# EAGLE design tiny13_charlie4_50mm_boosted_optical_diag_leafpattern (EAGLE 6.2)
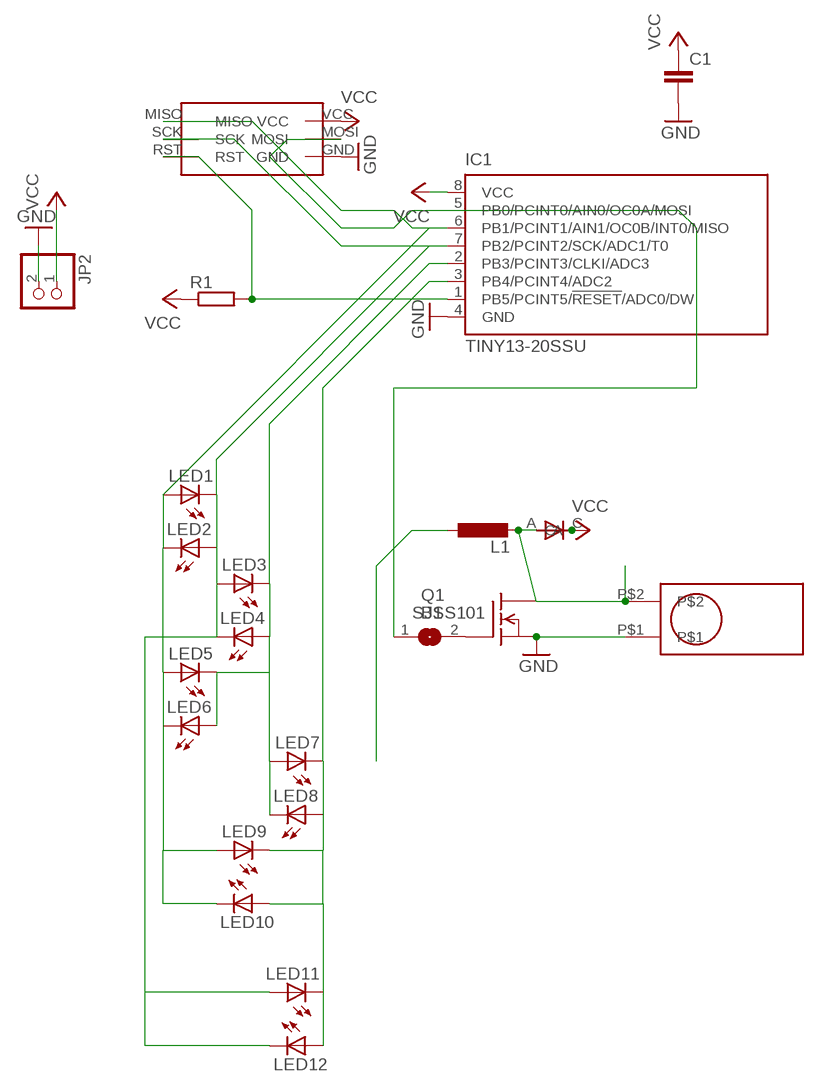
[diagram p0: schematic, sheet 1]

## Parts
C1  C-EU025-025X050  [C025-025X050]
IC1  TINY13-20SSU  [8S1]
JP2  PINHD-1X2  [1X02]
L1  L-EU0204/5  [0204/5]
LED1  LED3MM  [LED3MM]
LED2  LED3MM  [LED3MM]
LED3  LED3MM  [LED3MM]
LED4  LED3MM  [LED3MM]
LED5  LED3MM  [LED3MM]
LED6  LED3MM  [LED3MM]
LED7  LED3MM  [LED3MM]
LED8  LED3MM  [LED3MM]
LED9  LED3MM  [LED3MM]
LED10  LED3MM  [LED3MM]
LED11  LED3MM  [LED3MM]
LED12  LED3MM  [LED3MM]
Q1  BSS101  [TO92]
R1  R-EU_0204/5  [0204/5]
SJ1  SJ  [SJ]
U$1  TILT_SWITCH_MECHANICAL  [TILT_SWITCH_MECHANICAL]
U$2  AVR_ISP_6_PIN_1X6_SMT_CONTACT_PROGRAMMER  [CONTACT_ISP_PROGRAMMER_1X6_ATMEL_2]
U$3  D-6  [D-7.5]

## Nets
GND: C1.2 IC1.4(GND) JP2.2 Q1.1(S) U$1.P$1 U$2.GND
N$1: IC1.2(PB3/PCINT3/CLKI/ADC3) LED3.K(C) LED4.A LED5.K(C) LED6.A LED7.A LED8.K(C)
N$2: IC1.7(PB2/PCINT2/SCK/ADC1/T0) LED1.K(C) LED2.A LED3.A LED4.K(C) LED11.A LED12.K(C) U$2.SCK
N$3: L1.2 Q1.3(D) U$1.P$2 U$3.A
N$4: IC1.3(PB4/PCINT4/ADC2) LED7.K(C) LED8.A LED9.K(C) LED10.A LED11.K(C) LED12.A
N$5: IC1.5(PB0/PCINT0/AIN0/OC0A/MOSI) SJ1.1 U$2.MOSI
N$6: IC1.1(PB5/PCINT5/!RESET!/ADC0/DW) R1.2 U$2.RST
N$8: IC1.6(PB1/PCINT1/AIN1/OC0B/INT0/MISO) LED1.A LED2.K(C) LED5.A LED6.K(C) LED9.A LED10.K(C) U$2.MISO
N$9: Q1.2(G) SJ1.2
N$11: L1.1
VCC: C1.1 IC1.8(VCC) JP2.1 R1.1 U$2.VCC U$3.C

## Library data of the parts
C1 = resistor:C-EU: CAPACITOR, European symbol
IC1 = atmel:TINY13: 8-bit AVR Microcontroller with 1K Bytes In-System Programmable Flash Source: http://www.atmel.com/dyn/resources/prod_documents/2535S.pdf; MPN: ATTINY13-20SSU; OC_FARNELL: 1455133; OC_NEWARK: 58M3771
JP2 = pinhead:PINHD-1X2: PIN HEADER
L1 = rcl:L-EU: INDUCTOR, European symbol
LED1-LED12 = 0-svo:LED: LED OSRAM: - CHIPLED LG R971, LG N971, LY N971, LG Q971, LY Q971, LO R971, LY R971 LH N974, LH R974 LS Q976, LO Q976, LY Q976 LO Q996 - Hyper CHIPLED LW Q18S LB Q993, LB Q99A, LB R99A - SideLED LS A670, LO A670, LY A670, LG A670, LP A670 LB A673, LV A673, LT A673, LW A673 LH A674 LY A675 LS A676, LA A676, LO A676, LY A676, LW A676 LS A679, LY A679, LG A679 - Hyper Micro SIDELED® LS Y876, LA Y876, LO Y876, LY Y876 LT Y87S - SmartLED LW L88C, LW L88S LB L89C, LB L89S, LG L890 LS L89K, LO L89K, LY L89K LS L896, LA L896, LO L896, LY L896 - TOPLED LS T670, LO T670, LY T670, LG T670, LP T670 LSG T670, LSP T670, LSY T670, LOP T670, LYG T670 LG T671, LOG T671, LSG T671 LB T673, LV T673, LT T673, LW T673 LH T674 LS T676, LA T676, LO T676, LY T676, LB T676, LH T676, LSB T676, LW T676 LB T67C, LV T67C, LT T67C, LS T67K, LO T67K, LY T67K, LW E67C LS E67B, LA E67B, LO E67B, LY E67B, LB E67C, LV E67C, LT E67C LW T67C LS T679, LY T679, LG T679 LS T770, LO T770, LY T770, LG T770, LP T770 LB T773, LV T773, LT T773, LW T773 LH T774 LS E675, LA E675, LY E675, LS T675 LS T776, LA T776, LO T776, LY T776, LB T776 LHGB T686 LT T68C, LB T68C - Hyper Mini TOPLED® LB M676 - Mini TOPLED Santana® LG M470 LS M47K, LO M47K, LY M47K Source: http://www.osram.convergy.de/
Q1 = transistor-fet:BSS101: N-Channel Enhancement MOSFET 200V; 0,16A; 11Ohm
R1 = resistor:R-EU_: RESISTOR, European symbol
SJ1 = jumper:SJ: SMD solder JUMPER
U$1 = Mrule:TILT_SWITCH_MECHANICAL
U$2 = Mrule:AVR_ISP_6_PIN_1X6_SMT_CONTACT_PROGRAMMER
U$3 = Mrule:D-6

## Board
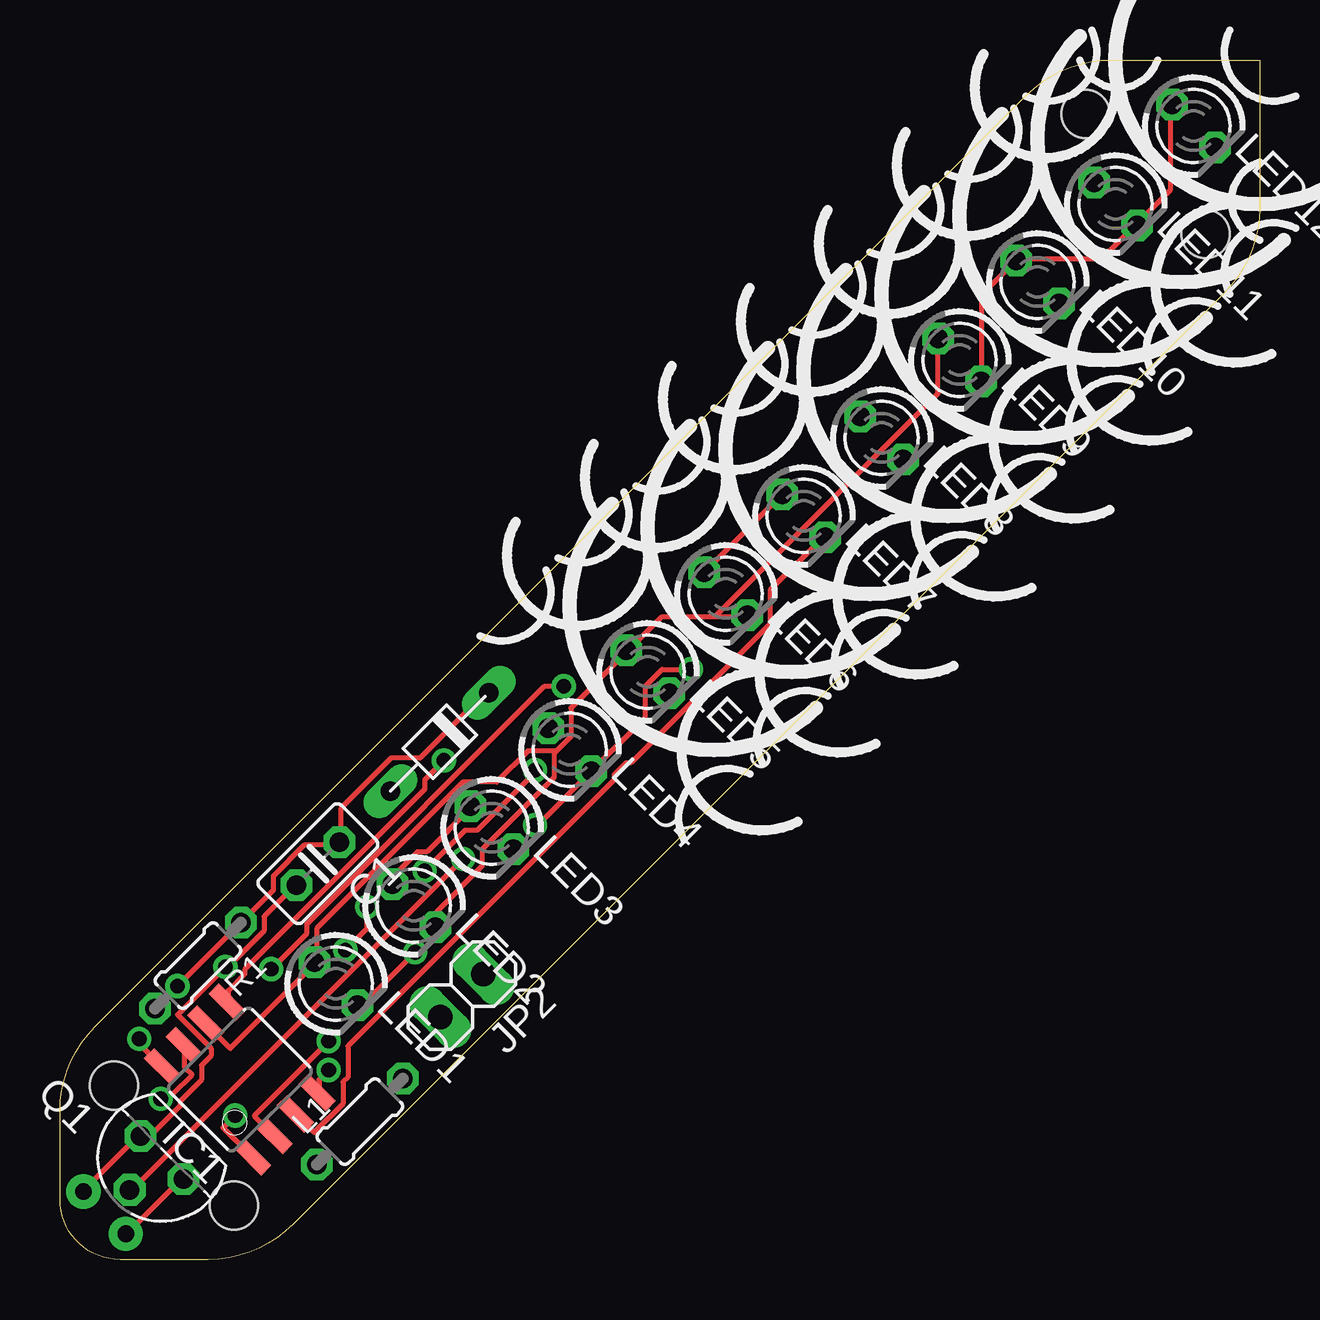
[diagram p1: board, top side]
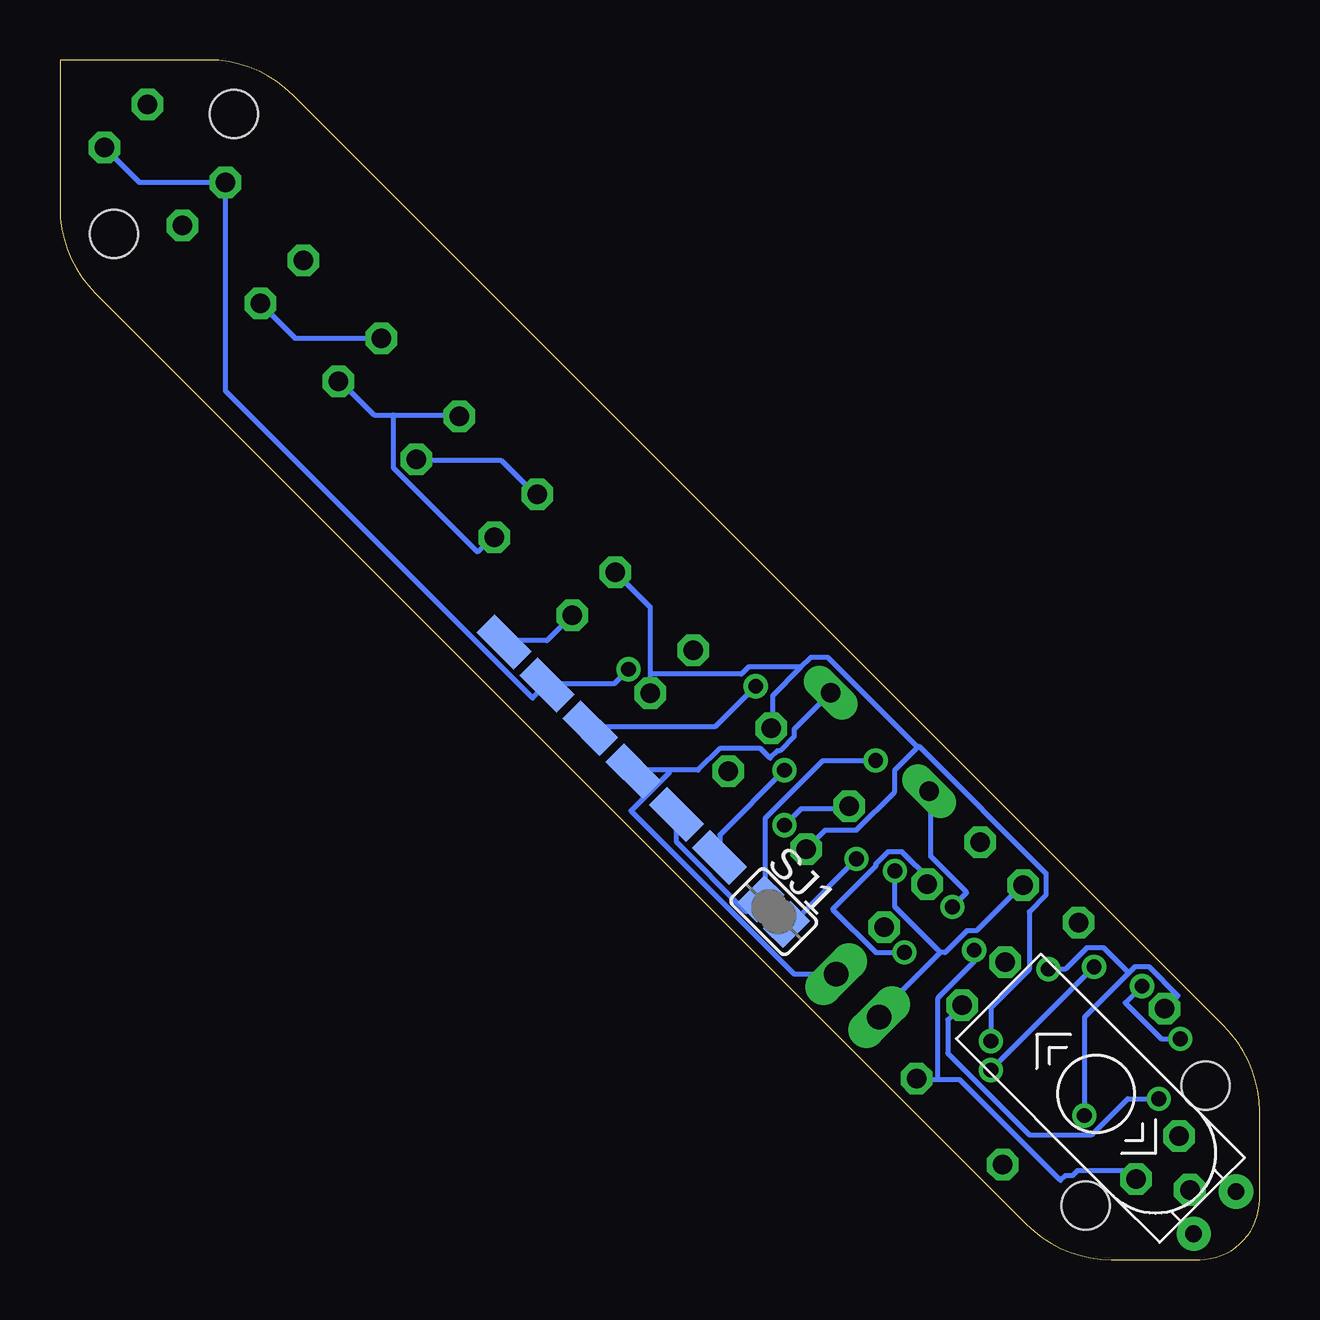
[diagram p2: board, bottom side, seen from below]

Size 50 x 50 mm. Coordinates in mm from the lower left corner, seen from the top.
Outline: 43.82,50 50,50 50,43.82 arc-45 48.54,40.29 9.71,1.46 arc-45 6.18,0 2.5,0 arc-90 0,2.5 0,6.18 arc-45 1.46,9.71 40.29,48.54 arc-45 43.82,50
Copper layers (1*16): Top 0.035mm / dielectric 1.5mm / Bottom 0.035mm
Design rules: minimum track width 8mil, minimum drill 24mil, track to track 6mil, track to pad 6mil, pad to pad 6mil, via to via 6mil, smd to smd 0mil, copper to edge 10mil, drill to drill 8mil, minimum pad ring 10mil, minimum via ring 8mil, stop-mask expansion 4mil, vias tented up to drill 0mil, thermal gap 10mil
Holes 2 mm at 42.75,47.75 47.75,42.75 7.25,2.25 2.25,7.25

### Footprints (pad centres in the part's own frame; a part is rotated, then mirrored left to right if it is on the bottom)
C025-025X050 = drill 0.813 octagon: 1 -1.27,0; 2 1.27,0
8S1 = smd 0.6 x 1.6: 1 -1.905,-2.654; 2 -0.645,-2.654; 3 0.625,-2.654; 4 1.895,-2.654; 5 1.905,2.654; 6 0.635,2.654; 7 -0.635,2.654; 8 -1.905,2.654
1X02 = drill 1.016 long: 1 -1.27,0; 2 1.27,0
0204/5 = drill 0.813 octagon: 1 -2.54,0; 2 2.54,0
LED3MM = drill 0.813 octagon: A -1.27,0; K 1.27,0
TO92 = drill 0.813 octagon: 1 1.27,0; 2 0,1.905; 3 -1.27,0
SJ = smd 1.168 x 1.6: 1 -0.762,0; 2 0.762,0
TILT_SWITCH_MECHANICAL = drill 0.7 pad 1.422: P$1 -0.75,1.25; P$2 -0.75,3.75
CONTACT_ISP_PROGRAMMER_1X6_ATMEL_2 = smd 2.184 x 1.067: GND 6.35,0; MISO -6.35,0; MOSI 3.81,0; RST -1.27,0; SCK -3.81,0; VCC 1.27,0
D-7.5 = drill 0.813 long: A 2.81,0; C -3,0

### Placement (x,y rotation side)
C1  10.75,16.5 225 top
IC1  7.5,7.5 45 top
JP2  16.75,11 225 top
L1  12.5,5.75 45 top
LED1  11.5,11.5 315 top
LED2  14.75,14.75 315 top
LED3  18,18 315 top
LED4  21.25,21.25 315 top
LED5  24.5,24.5 315 top
LED6  27.75,27.75 315 top
LED7  31,31 315 top
LED8  34.25,34.25 315 top
LED9  37.5,37.5 315 top
LED10  40.75,40.75 315 top
LED11  44,44 315 top
LED12  47.25,47.25 315 top
Q1  4.25,4.25 135 top
R1  5.75,12.25 225 top
SJ1  20.25,14.5 315 bottom
U$1  0.62,4.25 135 bottom
U$2  27,21.25 315 bottom
U$3  15.75,21.5 225 top

### Tracks (layer width: path | path; a pad name or v marks a point on that pad's centre or on a via)
GND  (via drill 0.61)
  Top 0.203: v19.8,20.4 19.8,20.3 17.4,17.9 16.9,17.9 v15.2,16.2 | U$1.P$1 1,2.9 3.2,5.1 3.3,5.1 Q1.1 3.4,5.2 3.8,5.2 5,6.4 5,6.6 5.9,7.5 5.9,8.1 6.3,8.5 6.3,8.8 4.9,10.2 v6.9,12.2 7,12.2 8.5,13.7 8.5,14.3 9.8,15.6 C1.2 | v11.2,7.9 10.8,7.5 10.8,7 IC1.4
  Bottom 0.203: v19.8,20.4 22.5,17.7 22.5,16.8 U$2.GND | v15.2,16.2 15.2,14.7 13.3,12.8 | 13.3,12.8 15.9,10.2 JP2.2 | v6.9,12.2 v11.2,7.9 | 13.3,12.8 13.1,12.8 12.2,13.7 11.8,13.7 9.9,15.6 C1.2
N$1  (via drill 0.61)
  Top 0.203: LED7.A 30.1,31.8 30,31.8 26.9,28.7 LED6.A | v11.2,9.1 8.1,6 8.9,5.2 IC1.2
  Bottom 0.203: 25.4,24.4 25.4,27.2 26.8,28.6 LED6.A | 25.4,24.4 25.4,23.7 LED5.K | LED8.K 35.1,33.3 31.6,33.3 30.2,31.9 LED7.A | v11.2,9.1 11.2,10.5 9.6,12.1 9.6,14.5 8.9,15.2 8.9,16.1 14.2,21.4 | 14.2,21.4 15.2,20.4 15.2,19.5 16.8,17.9 18.1,17.9 18.8,17.2 LED3.K | 19.15,24.65 18.7,25.1 18,25.1 14.3,21.4 14.2,21.4 | 19.15,24.65 20.3,23.5 20.3,22.2 LED4.A | 25.4,24.4 21.6,24.4 21.3,24.7 19.2,24.7 19.15,24.65
N$2  (via drill 0.61)
  Top 0.203: v4.2,6.7 4.4,6.9 4.7,6.9 5.5,7.7 5.2,8 5.2,8.9 IC1.7 | LED2.A 13.9,15.7 13.9,16 14.9,17 15.3,17 17.1,18.8 LED3.A | v26.3,24.6 25.1,24.6 24.4,23.9 24.4,22.6 22.2,20.4 LED4.K 22.1,20.3 19.9,18.1 v19.8,18.1 | v14.8,12.8 12.7,10.7 12.4,10.7 LED1.K
  Bottom 0.203: v4.2,6.7 5.5,6.7 7,5.2 9.6,5.2 13,8.6 13,10 LED1.K | LED12.K 48.1,46.3 46.7,44.9 43.2,44.9 LED11.A 43.1,44.8 43.1,36.2 30.3,23.4 29.7,24 U$2.SCK 29.6,24 26.9,24 v26.3,24.6 | v19.8,18.1 19.1,18.8 17.2,18.8 LED3.A | v14.8,12.8 16,12.8 17.8,14.6 16,16.4 16,16.5 15.5,17 14.9,17 13.7,15.8 13.8,15.7 LED2.A
N$3  (via drill 0.61)
  Top 0.203: Q1.3 5.1,3.3 5,3.3 2.8,1.1 U$1.P$2 | v12.8,14.7 12.8,13.8 v11.9,12.9
  Bottom 0.203: 13.4,7.5 12.5,7.5 8.3,3.3 8.1,3.5 7.8,3.5 7.6,3.7 5.5,3.7 5.2,3.4 Q1.3 | 13.4,7.5 14.2,7.5 L1.2 | v12.8,14.7 12.2,15.3 13.7,16.8 13.7,19.5 U$3.A | v11.9,12.9 11.9,12.4 13.4,10.9 13.4,7.5
N$4
  Top 0.203: LED12.A 46.3,48.1 46.3,44.6 44.9,43.2 LED11.K 44.8,43.1 43.4,41.7 39.9,41.7 LED10.A 39.8,41.6 38.4,40.2 38.4,36.7 LED9.K | IC1.3 9.9,6 10.6,5.3 11.8,6.5 11.8,7.4 12,7.6 12,8.9 23.1,20 23.1,20.2 23.6,20.7 23.8,20.7 29.6,26.5 29.6,27.9 31.8,30.1 LED7.K
  Bottom 0.203: 36.1,35.2 36.9,35.2 38.3,36.6 LED9.K | 36.1,35.2 33.4,35.2 LED8.A | 36.1,35.2 36.1,33 32.6,29.5 31.9,30.2 LED7.K
N$5  (via drill 0.61)
  Top 0.203: v16,20.8 15.2,20 15.2,19.6 7.7,12.1 7.7,11.9 7,11.2 7,10.8 IC1.5
  Bottom 0.203: v16,20.8 18.2,20.8 20.6,18.4 20.6,15.2 20.7,15.1 SJ1.1 20.8,15.1 21.4,14.5 24.3,17.4 24.3,18.5 U$2.MOSI
N$6  (via drill 0.61)
  Top 0.203: v7.3,6 6.8,5.5 8,4.3 IC1.1 | v21,23.9 20.2,23.9 10.3,14 10.3,13.6 v8.8,12.1
  Bottom 0.203: v7.3,6 7.3,10.1 5.45,11.95 | 5.45,11.95 5.2,12.2 4.6,12.2 3.4,11 3.9,10.5 R1.2 | v21,23.9 22.7,22.2 27.8,22.2 U$2.RST | v8.8,12.1 8.1,12.1 7.2,13 6.5,13 5.45,11.95
N$8
  Top 0.203: IC1.6 6.1,9.8 7.1,8.8 10.6,12.3 LED1.A 10.7,12.4 10.7,13.8 16.8,19.9 18.2,19.9 19.5,21.2 20.6,21.2 20.6,21.1 | 20.6,21.1 20.6,20.1 17.6,17.1 17.6,16.4 15.7,14.5 15.7,13.9 LED2.K | 20.6,21.1 21.3,21.8 21.3,23 23.6,25.3 LED5.A 23.7,25.4 25.1,26.8 27.4,26.8 | 27.4,26.8 28.6,26.8 LED6.K | LED9.A 36.6,38.3 36.6,36.1 27.4,26.9 27.4,26.8
  Bottom 0.203: LED9.A 36.7,38.4 40.2,38.4 41.6,39.8 LED10.K | U$2.MISO 31.4,25.8 29.7,25.8 28.7,26.8 LED6.K
N$9  (via drill 0.61)
  Top 0.203: v16.8,16.7 3,2.9 Q1.2
  Bottom 0.203: v16.8,16.7 19.5,14 19.7,14 SJ1.2
VCC  (via drill 0.61)
  Top 0.203: v3.3,9.2 3.2,9.1 4.2,8.1 IC1.8 | v4.9,11.4 R1.1 8.9,15.4 8.9,16 10.2,17.3 11.6,17.3 C1.1 11.7,17.4 11.7,18.8 13.8,20.9 15,20.9 17.8,23.7 U$3.C
  Bottom 0.203: v3.3,9.2 4.1,9.2 5.6,10.7 v4.9,11.4 | 24.6,20.4 23.4,20.4 22.5,21.3 20.8,21.3 20.4,20.9 20.1,21.2 20,21.2 19.4,21.8 19.4,22.1 17.9,23.6 U$3.C | 24.6,20.4 26.1,20.4 U$2.VCC | JP2.1 17.7,11.9 19.4,11.9 26.2,18.7 24.6,20.3 24.6,20.4